# Altium schematic sheet WAB_1x4_bus_transceivers.SchDoc
size A2
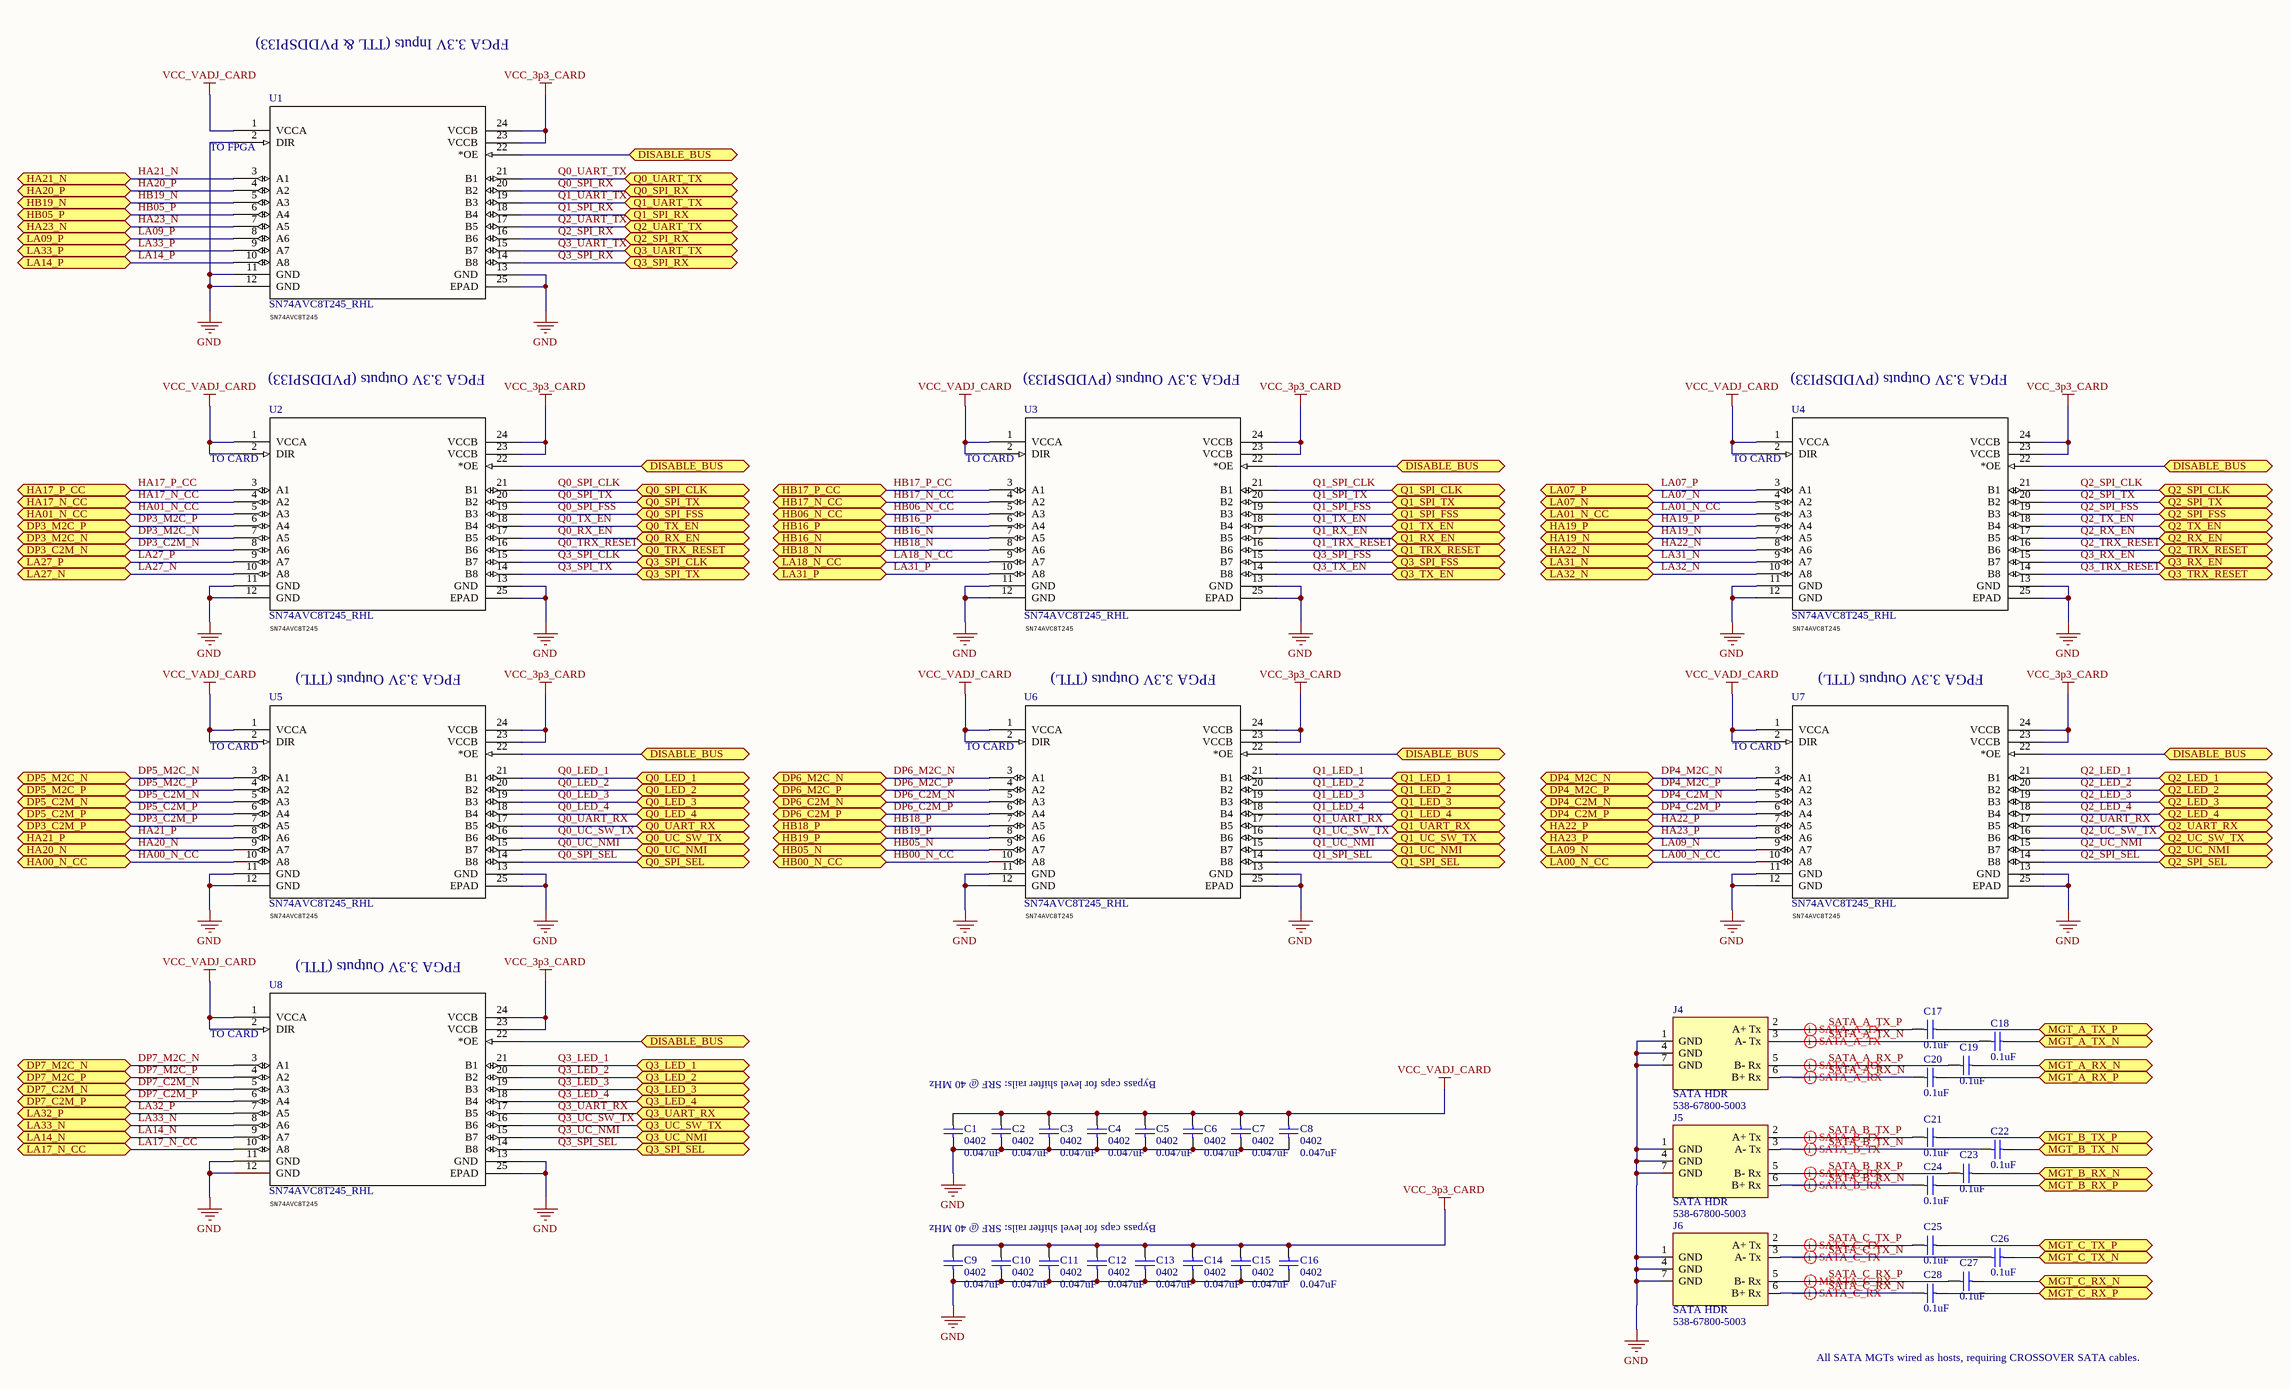
[diagram p0: WAB_1x4_bus_transceivers.SchDoc]

## Parts
C1  0402  value 0.047uF  [0402_SMT_CAP]
C2  0402  value 0.047uF  [0402_SMT_CAP]
C3  0402  value 0.047uF  [0402_SMT_CAP]
C4  0402  value 0.047uF  [0402_SMT_CAP]
C5  0402  value 0.047uF  [0402_SMT_CAP]
C6  0402  value 0.047uF  [0402_SMT_CAP]
C7  0402  value 0.047uF  [0402_SMT_CAP]
C8  0402  value 0.047uF  [0402_SMT_CAP]
C9  0402  value 0.047uF  [0402_SMT_CAP]
C10  0402  value 0.047uF  [0402_SMT_CAP]
C11  0402  value 0.047uF  [0402_SMT_CAP]
C12  0402  value 0.047uF  [0402_SMT_CAP]
C13  0402  value 0.047uF  [0402_SMT_CAP]
C14  0402  value 0.047uF  [0402_SMT_CAP]
C15  0402  value 0.047uF  [0402_SMT_CAP]
C16  0402  value 0.047uF  [0402_SMT_CAP]
C17  value 0.1uF  [0402_SMT_CAP]  (hidden comment: 0402)
C18  value 0.1uF  [0402_SMT_CAP]  (hidden comment: 0402)
C19  value 0.1uF  [0402_SMT_CAP]  (hidden comment: 0402)
C20  value 0.1uF  [0402_SMT_CAP]  (hidden comment: 0402)
C21  value 0.1uF  [0402_SMT_CAP]  (hidden comment: 0402)
C22  value 0.1uF  [0402_SMT_CAP]  (hidden comment: 0402)
C23  value 0.1uF  [0402_SMT_CAP]  (hidden comment: 0402)
C24  value 0.1uF  [0402_SMT_CAP]  (hidden comment: 0402)
C25  value 0.1uF  [0402_SMT_CAP]  (hidden comment: 0402)
C26  value 0.1uF  [0402_SMT_CAP]  (hidden comment: 0402)
C27  value 0.1uF  [0402_SMT_CAP]  (hidden comment: 0402)
C28  value 0.1uF  [0402_SMT_CAP]  (hidden comment: 0402)
J4  SATA HDR  Supplier Part Number 1: 538-67800-5003  [Molex_67800-5003_V2]
J5  SATA HDR  Supplier Part Number 1: 538-67800-5003  [Molex_67800-5003_V2]
J6  SATA HDR  Supplier Part Number 1: 538-67800-5003  [Molex_67800-5003_V2]
U1  SN74AVC8T245_RHL  GENERIC_PART_NUMBER: SN74AVC8T245  [RHL24_4P05X2P05_V3]
U2  SN74AVC8T245_RHL  GENERIC_PART_NUMBER: SN74AVC8T245  [RHL24_4P05X2P05_V3]
U3  SN74AVC8T245_RHL  GENERIC_PART_NUMBER: SN74AVC8T245  [RHL24_4P05X2P05_V3]
U4  SN74AVC8T245_RHL  GENERIC_PART_NUMBER: SN74AVC8T245  [RHL24_4P05X2P05_V3]
U5  SN74AVC8T245_RHL  GENERIC_PART_NUMBER: SN74AVC8T245  [RHL24_4P05X2P05_V3]
U6  SN74AVC8T245_RHL  GENERIC_PART_NUMBER: SN74AVC8T245  [RHL24_4P05X2P05_V3]
U7  SN74AVC8T245_RHL  GENERIC_PART_NUMBER: SN74AVC8T245  [RHL24_4P05X2P05_V3]
U8  SN74AVC8T245_RHL  GENERIC_PART_NUMBER: SN74AVC8T245  [RHL24_4P05X2P05_V3]

## Ports
DISABLE_BUS (bidir), DP3_C2M_N (bidir), DP3_C2M_P (bidir), DP3_M2C_N (bidir), DP3_M2C_P (bidir), DP4_C2M_N (bidir), DP4_C2M_P (bidir), DP4_M2C_N (bidir), DP4_M2C_P (bidir), DP5_C2M_N (bidir), DP5_C2M_P (bidir), DP5_M2C_N (bidir), DP5_M2C_P (bidir), DP6_C2M_N (bidir), DP6_C2M_P (bidir), DP6_M2C_N (bidir), DP6_M2C_P (bidir), DP7_C2M_N (bidir), DP7_C2M_P (bidir), DP7_M2C_N (bidir), DP7_M2C_P (bidir), HA00_N_CC (bidir), HA01_N_CC (bidir), HA17_N_CC (bidir), HA17_P_CC (bidir), HA19_N (bidir), HA19_P (bidir), HA20_N (bidir), HA20_P (bidir), HA21_N (bidir), HA21_P (bidir), HA22_N (bidir), HA22_P (bidir), HA23_N (bidir), HA23_P (bidir), HB00_N_CC (bidir), HB05_N (bidir), HB05_P (bidir), HB06_N_CC (bidir), HB16_N (bidir), HB16_P (bidir), HB17_N_CC (bidir), HB17_P_CC (bidir), HB18_N (bidir), HB18_P (bidir), HB19_N (bidir), HB19_P (bidir), LA00_N_CC (bidir), LA01_N_CC (bidir), LA07_N (bidir), LA07_P (bidir), LA09_N (bidir), LA09_P (bidir), LA14_N (bidir), LA14_P (bidir), LA17_N_CC (bidir), LA18_N_CC (bidir), LA27_N (bidir), LA27_P (bidir), LA31_N (bidir), LA31_P (bidir), LA32_N (bidir), LA32_P (bidir), LA33_N (bidir), LA33_P (bidir), MGT_A_RX_N (bidir), MGT_A_RX_P (bidir), MGT_A_TX_N (bidir), MGT_A_TX_P (bidir), MGT_B_RX_N (bidir), MGT_B_RX_P (bidir), MGT_B_TX_N (bidir), MGT_B_TX_P (bidir), MGT_C_RX_N (bidir), MGT_C_RX_P (bidir), MGT_C_TX_N (bidir), MGT_C_TX_P (bidir), Q0_LED_1 (bidir), Q0_LED_2 (bidir), Q0_LED_3 (bidir), Q0_LED_4 (bidir), Q0_RX_EN (bidir), Q0_SPI_CLK (bidir), Q0_SPI_FSS (bidir), Q0_SPI_RX (bidir), Q0_SPI_SEL (bidir), Q0_SPI_TX (bidir), Q0_TRX_RESET (bidir), Q0_TX_EN (bidir), Q0_UART_RX (bidir), Q0_UART_TX (bidir), Q0_UC_NMI (bidir), Q0_UC_SW_TX (bidir), Q1_LED_1 (bidir), Q1_LED_2 (bidir), Q1_LED_3 (bidir), Q1_LED_4 (bidir), Q1_RX_EN (bidir), Q1_SPI_CLK (bidir), Q1_SPI_FSS (bidir), Q1_SPI_RX (bidir), Q1_SPI_SEL (bidir), Q1_SPI_TX (bidir), Q1_TRX_RESET (bidir), Q1_TX_EN (bidir), Q1_UART_RX (bidir), Q1_UART_TX (bidir), Q1_UC_NMI (bidir), Q1_UC_SW_TX (bidir), Q2_LED_1 (bidir), Q2_LED_2 (bidir), Q2_LED_3 (bidir), Q2_LED_4 (bidir), Q2_RX_EN (bidir), Q2_SPI_CLK (bidir), Q2_SPI_FSS (bidir), Q2_SPI_RX (bidir), Q2_SPI_SEL (bidir), Q2_SPI_TX (bidir), Q2_TRX_RESET (bidir), Q2_TX_EN (bidir), Q2_UART_RX (bidir), Q2_UART_TX (bidir), Q2_UC_NMI (bidir), Q2_UC_SW_TX (bidir), Q3_LED_1 (bidir), Q3_LED_2 (bidir), Q3_LED_3 (bidir), Q3_LED_4 (bidir), Q3_RX_EN (bidir), Q3_SPI_CLK (bidir), Q3_SPI_FSS (bidir), Q3_SPI_RX (bidir), Q3_SPI_SEL (bidir), Q3_SPI_TX (bidir), Q3_TRX_RESET (bidir), Q3_TX_EN (bidir), Q3_UART_RX (bidir), Q3_UART_TX (bidir), Q3_UC_NMI (bidir), Q3_UC_SW_TX (bidir)

## Nets
GND: C1.2 C2.2 C3.2 C4.2 C5.2 C6.2 C7.2 C8.2 C9.2 C10.2 C11.2 C12.2 C13.2 C14.2 C15.2 C16.2 J4.1(GND) J4.4(GND) J4.7(GND) J5.1(GND) J5.4(GND) J5.7(GND) J6.1(GND) J6.4(GND) J6.7(GND) U1.2(DIR) U1.11(GND) U1.12(GND) U1.13(GND) U1.25(EPAD) U2.11(GND) U2.12(GND) U2.13(GND) U2.25(EPAD) U3.11(GND) U3.12(GND) U3.13(GND) U3.25(EPAD) U4.11(GND) U4.12(GND) U4.13(GND) U4.25(EPAD) U5.11(GND) U5.12(GND) U5.13(GND) U5.25(EPAD) U6.11(GND) U6.12(GND) U6.13(GND) U6.25(EPAD) U7.11(GND) U7.12(GND) U7.13(GND) U7.25(EPAD) U8.11(GND) U8.12(GND) U8.13(GND) U8.25(EPAD)
VCC_3p3_CARD: C9.1 C10.1 C11.1 C12.1 C13.1 C14.1 C15.1 C16.1 U1.23(VCCB) U1.24(VCCB) U2.23(VCCB) U2.24(VCCB) U3.23(VCCB) U3.24(VCCB) U4.23(VCCB) U4.24(VCCB) U5.23(VCCB) U5.24(VCCB) U6.23(VCCB) U6.24(VCCB) U7.23(VCCB) U7.24(VCCB) U8.23(VCCB) U8.24(VCCB)
VCC_VADJ_CARD: C1.1 C2.1 C3.1 C4.1 C5.1 C6.1 C7.1 C8.1 U1.1(VCCA) U2.1(VCCA) U2.2(DIR) U3.1(VCCA) U3.2(DIR) U4.1(VCCA) U4.2(DIR) U5.1(VCCA) U5.2(DIR) U6.1(VCCA) U6.2(DIR) U7.1(VCCA) U7.2(DIR) U8.1(VCCA) U8.2(DIR)
DISABLE_BUS: U1.22(*OE) U2.22(*OE) U3.22(*OE) U4.22(*OE) U5.22(*OE) U6.22(*OE) U7.22(*OE) U8.22(*OE) ; port DISABLE_BUS
DP3_C2M_N: U2.8(A6) ; port DP3_C2M_N
DP3_C2M_P: U5.7(A5) ; port DP3_C2M_P
DP3_M2C_N: U2.7(A5) ; port DP3_M2C_N
DP3_M2C_P: U2.6(A4) ; port DP3_M2C_P
DP4_C2M_N: U7.5(A3) ; port DP4_C2M_N
DP4_C2M_P: U7.6(A4) ; port DP4_C2M_P
DP4_M2C_N: U7.3(A1) ; port DP4_M2C_N
DP4_M2C_P: U7.4(A2) ; port DP4_M2C_P
DP5_C2M_N: U5.5(A3) ; port DP5_C2M_N
DP5_C2M_P: U5.6(A4) ; port DP5_C2M_P
DP5_M2C_N: U5.3(A1) ; port DP5_M2C_N
DP5_M2C_P: U5.4(A2) ; port DP5_M2C_P
DP6_C2M_N: U6.5(A3) ; port DP6_C2M_N
DP6_C2M_P: U6.6(A4) ; port DP6_C2M_P
DP6_M2C_N: U6.3(A1) ; port DP6_M2C_N
DP6_M2C_P: U6.4(A2) ; port DP6_M2C_P
DP7_C2M_N: U8.5(A3) ; port DP7_C2M_N
DP7_C2M_P: U8.6(A4) ; port DP7_C2M_P
DP7_M2C_N: U8.3(A1) ; port DP7_M2C_N
DP7_M2C_P: U8.4(A2) ; port DP7_M2C_P
HA00_N_CC: U5.10(A8) ; port HA00_N_CC
HA01_N_CC: U2.5(A3) ; port HA01_N_CC
HA17_N_CC: U2.4(A2) ; port HA17_N_CC
HA17_P_CC: U2.3(A1) ; port HA17_P_CC
HA19_N: U4.7(A5) ; port HA19_N
HA19_P: U4.6(A4) ; port HA19_P
HA20_N: U5.9(A7) ; port HA20_N
HA20_P: U1.4(A2) ; port HA20_P
HA21_N: U1.3(A1) ; port HA21_N
HA21_P: U5.8(A6) ; port HA21_P
HA22_N: U4.8(A6) ; port HA22_N
HA22_P: U7.7(A5) ; port HA22_P
HA23_N: U1.7(A5) ; port HA23_N
HA23_P: U7.8(A6) ; port HA23_P
HB00_N_CC: U6.10(A8) ; port HB00_N_CC
HB05_N: U6.9(A7) ; port HB05_N
HB05_P: U1.6(A4) ; port HB05_P
HB06_N_CC: U3.5(A3) ; port HB06_N_CC
HB16_N: U3.7(A5) ; port HB16_N
HB16_P: U3.6(A4) ; port HB16_P
HB17_N_CC: U3.4(A2) ; port HB17_N_CC
HB17_P_CC: U3.3(A1) ; port HB17_P_CC
HB18_N: U3.8(A6) ; port HB18_N
HB18_P: U6.7(A5) ; port HB18_P
HB19_N: U1.5(A3) ; port HB19_N
HB19_P: U6.8(A6) ; port HB19_P
LA00_N_CC: U7.10(A8) ; port LA00_N_CC
LA01_N_CC: U4.5(A3) ; port LA01_N_CC
LA07_N: U4.4(A2) ; port LA07_N
LA07_P: U4.3(A1) ; port LA07_P
LA09_N: U7.9(A7) ; port LA09_N
LA09_P: U1.8(A6) ; port LA09_P
LA14_N: U8.9(A7) ; port LA14_N
LA14_P: U1.10(A8) ; port LA14_P
LA17_N_CC: U8.10(A8) ; port LA17_N_CC
LA18_N_CC: U3.9(A7) ; port LA18_N_CC
LA27_N: U2.10(A8) ; port LA27_N
LA27_P: U2.9(A7) ; port LA27_P
LA31_N: U4.9(A7) ; port LA31_N
LA31_P: U3.10(A8) ; port LA31_P
LA32_N: U4.10(A8) ; port LA32_N
LA32_P: U8.7(A5) ; port LA32_P
LA33_N: U8.8(A6) ; port LA33_N
LA33_P: U1.9(A7) ; port LA33_P
MGT_A_RX_N: C19.2 ; port MGT_A_RX_N
MGT_A_RX_P: C20.2 ; port MGT_A_RX_P
MGT_A_TX_N: C18.2 ; port MGT_A_TX_N
MGT_A_TX_P: C17.2 ; port MGT_A_TX_P
MGT_B_RX_N: C23.2 ; port MGT_B_RX_N
MGT_B_RX_P: C24.2 ; port MGT_B_RX_P
MGT_B_TX_N: C22.2 ; port MGT_B_TX_N
MGT_B_TX_P: C21.2 ; port MGT_B_TX_P
MGT_C_RX_N: C27.2 ; port MGT_C_RX_N
MGT_C_RX_P: C28.2 ; port MGT_C_RX_P
MGT_C_TX_N: C26.2 ; port MGT_C_TX_N
MGT_C_TX_P: C25.2 ; port MGT_C_TX_P
Q0_LED_1: U5.21(B1) ; port Q0_LED_1
Q0_LED_2: U5.20(B2) ; port Q0_LED_2
Q0_LED_3: U5.19(B3) ; port Q0_LED_3
Q0_LED_4: U5.18(B4) ; port Q0_LED_4
Q0_RX_EN: U2.17(B5) ; port Q0_RX_EN
Q0_SPI_CLK: U2.21(B1) ; port Q0_SPI_CLK
Q0_SPI_FSS: U2.19(B3) ; port Q0_SPI_FSS
Q0_SPI_RX: U1.20(B2) ; port Q0_SPI_RX
Q0_SPI_SEL: U5.14(B8) ; port Q0_SPI_SEL
Q0_SPI_TX: U2.20(B2) ; port Q0_SPI_TX
Q0_TRX_RESET: U2.16(B6) ; port Q0_TRX_RESET
Q0_TX_EN: U2.18(B4) ; port Q0_TX_EN
Q0_UART_RX: U5.17(B5) ; port Q0_UART_RX
Q0_UART_TX: U1.21(B1) ; port Q0_UART_TX
Q0_UC_NMI: U5.15(B7) ; port Q0_UC_NMI
Q0_UC_SW_TX: U5.16(B6) ; port Q0_UC_SW_TX
Q1_LED_1: U6.21(B1) ; port Q1_LED_1
Q1_LED_2: U6.20(B2) ; port Q1_LED_2
Q1_LED_3: U6.19(B3) ; port Q1_LED_3
Q1_LED_4: U6.18(B4) ; port Q1_LED_4
Q1_RX_EN: U3.17(B5) ; port Q1_RX_EN
Q1_SPI_CLK: U3.21(B1) ; port Q1_SPI_CLK
Q1_SPI_FSS: U3.19(B3) ; port Q1_SPI_FSS
Q1_SPI_RX: U1.18(B4) ; port Q1_SPI_RX
Q1_SPI_SEL: U6.14(B8) ; port Q1_SPI_SEL
Q1_SPI_TX: U3.20(B2) ; port Q1_SPI_TX
Q1_TRX_RESET: U3.16(B6) ; port Q1_TRX_RESET
Q1_TX_EN: U3.18(B4) ; port Q1_TX_EN
Q1_UART_RX: U6.17(B5) ; port Q1_UART_RX
Q1_UART_TX: U1.19(B3) ; port Q1_UART_TX
Q1_UC_NMI: U6.15(B7) ; port Q1_UC_NMI
Q1_UC_SW_TX: U6.16(B6) ; port Q1_UC_SW_TX
Q2_LED_1: U7.21(B1) ; port Q2_LED_1
Q2_LED_2: U7.20(B2) ; port Q2_LED_2
Q2_LED_3: U7.19(B3) ; port Q2_LED_3
Q2_LED_4: U7.18(B4) ; port Q2_LED_4
Q2_RX_EN: U4.17(B5) ; port Q2_RX_EN
Q2_SPI_CLK: U4.21(B1) ; port Q2_SPI_CLK
Q2_SPI_FSS: U4.19(B3) ; port Q2_SPI_FSS
Q2_SPI_RX: U1.16(B6) ; port Q2_SPI_RX
Q2_SPI_SEL: U7.14(B8) ; port Q2_SPI_SEL
Q2_SPI_TX: U4.20(B2) ; port Q2_SPI_TX
Q2_TRX_RESET: U4.16(B6) ; port Q2_TRX_RESET
Q2_TX_EN: U4.18(B4) ; port Q2_TX_EN
Q2_UART_RX: U7.17(B5) ; port Q2_UART_RX
Q2_UART_TX: U1.17(B5) ; port Q2_UART_TX
Q2_UC_NMI: U7.15(B7) ; port Q2_UC_NMI
Q2_UC_SW_TX: U7.16(B6) ; port Q2_UC_SW_TX
Q3_LED_1: U8.21(B1) ; port Q3_LED_1
Q3_LED_2: U8.20(B2) ; port Q3_LED_2
Q3_LED_3: U8.19(B3) ; port Q3_LED_3
Q3_LED_4: U8.18(B4) ; port Q3_LED_4
Q3_RX_EN: U4.15(B7) ; port Q3_RX_EN
Q3_SPI_CLK: U2.15(B7) ; port Q3_SPI_CLK
Q3_SPI_FSS: U3.15(B7) ; port Q3_SPI_FSS
Q3_SPI_RX: U1.14(B8) ; port Q3_SPI_RX
Q3_SPI_SEL: U8.14(B8) ; port Q3_SPI_SEL
Q3_SPI_TX: U2.14(B8) ; port Q3_SPI_TX
Q3_TRX_RESET: U4.14(B8) ; port Q3_TRX_RESET
Q3_TX_EN: U3.14(B8) ; port Q3_TX_EN
Q3_UART_RX: U8.17(B5) ; port Q3_UART_RX
Q3_UART_TX: U1.15(B7) ; port Q3_UART_TX
Q3_UC_NMI: U8.15(B7) ; port Q3_UC_NMI
Q3_UC_SW_TX: U8.16(B6) ; port Q3_UC_SW_TX
SATA_A_RX_N: C20.1 J4.6(B+_Rx)
SATA_A_RX_P: C19.1 J4.5(B-_Rx)
SATA_A_TX_N: C18.1 J4.3(A-_Tx)
SATA_A_TX_P: C17.1 J4.2(A+_Tx)
SATA_B_RX_N: C24.1 J5.6(B+_Rx)
SATA_B_RX_P: C23.1 J5.5(B-_Rx)
SATA_B_TX_N: C22.1 J5.3(A-_Tx)
SATA_B_TX_P: C21.1 J5.2(A+_Tx)
SATA_C_RX_N: C28.1 J6.6(B+_Rx)
SATA_C_RX_P: C27.1 J6.5(B-_Rx)
SATA_C_TX_N: C26.1 J6.3(A-_Tx)
SATA_C_TX_P: C25.1 J6.2(A+_Tx)

## Layout directives
differential pair: SATA_A_RX_N, SATA_A_RX_P, SATA_A_TX_N, SATA_A_TX_P, SATA_B_RX_N, SATA_B_RX_P, SATA_B_TX_N, SATA_B_TX_P, SATA_C_RX_N, SATA_C_RX_P, SATA_C_TX_N, SATA_C_TX_P

## Notes on the sheet
- FPGA 3.3V Inputs (TTL & PVDDSPI33)
- (near U1) TO FPGA
- FPGA 3.3V Outputs (PVDDSPI33)
- (near U2) TO CARD
- (near U3) TO CARD
- (near U4) TO CARD
- (near U5) FPGA 3.3V Outputs (TTL)
- (near U6) FPGA 3.3V Outputs (TTL)
- (near U7) FPGA 3.3V Outputs (TTL)
- (near U5) TO CARD
- (near U6) TO CARD
- (near U7) TO CARD
- (near U8) FPGA 3.3V Outputs (TTL)
- (near U8) TO CARD
- Bypass caps for level shifter rails: SRF @ 40 MHz
- All SATA MGTs wired as hosts, requiring CROSSOVER SATA cables.

## Library data of the parts
C1-C28 = Cap_0402: 0402 SMT Capacitor; Supplier 1: Mouser
  C1-C16: Supplier Part Number 1: 81-GRM155R71E473KA88
  C17-C28: Supplier Part Number 1: 81-GRM155R71C104KA88
J4-J6 = SATA-SMT-Jack: Molex SMT SATA Jack, Shrouded, 67800-5003; Supplier 1: Mouser
U1-U8 = SN74AVC8T245_RHL: 8-Bit Dual-Supply Bus Transceiver QFN 320 Mbps; Manufacturer: Texas Instruments; Manufacturer_Part_Number: sn74avc8t245_rhl_24; FAMILY_NAME: DIRECTION CONTROL DUAL SUPPLY TRANSLATOR; PIN_COUNT: 24; PACKAGE_DESIGNATOR: RHL; Datasheet URL: http://www.ti.com/lit/gpn/SN74AVC8T245; INDUSTRY_STD_PKG_TYPE: QFN; Vendor: Texas Instruments; RefDes: RefDes; Type: DEV; Value: Value; Supplier 1: Digi-Key; Supplier Part Number 1: 296-17859-1-ND